# Altium schematic sheet power.SchDoc
size A4; Revision: C.2(PCB.SCH)
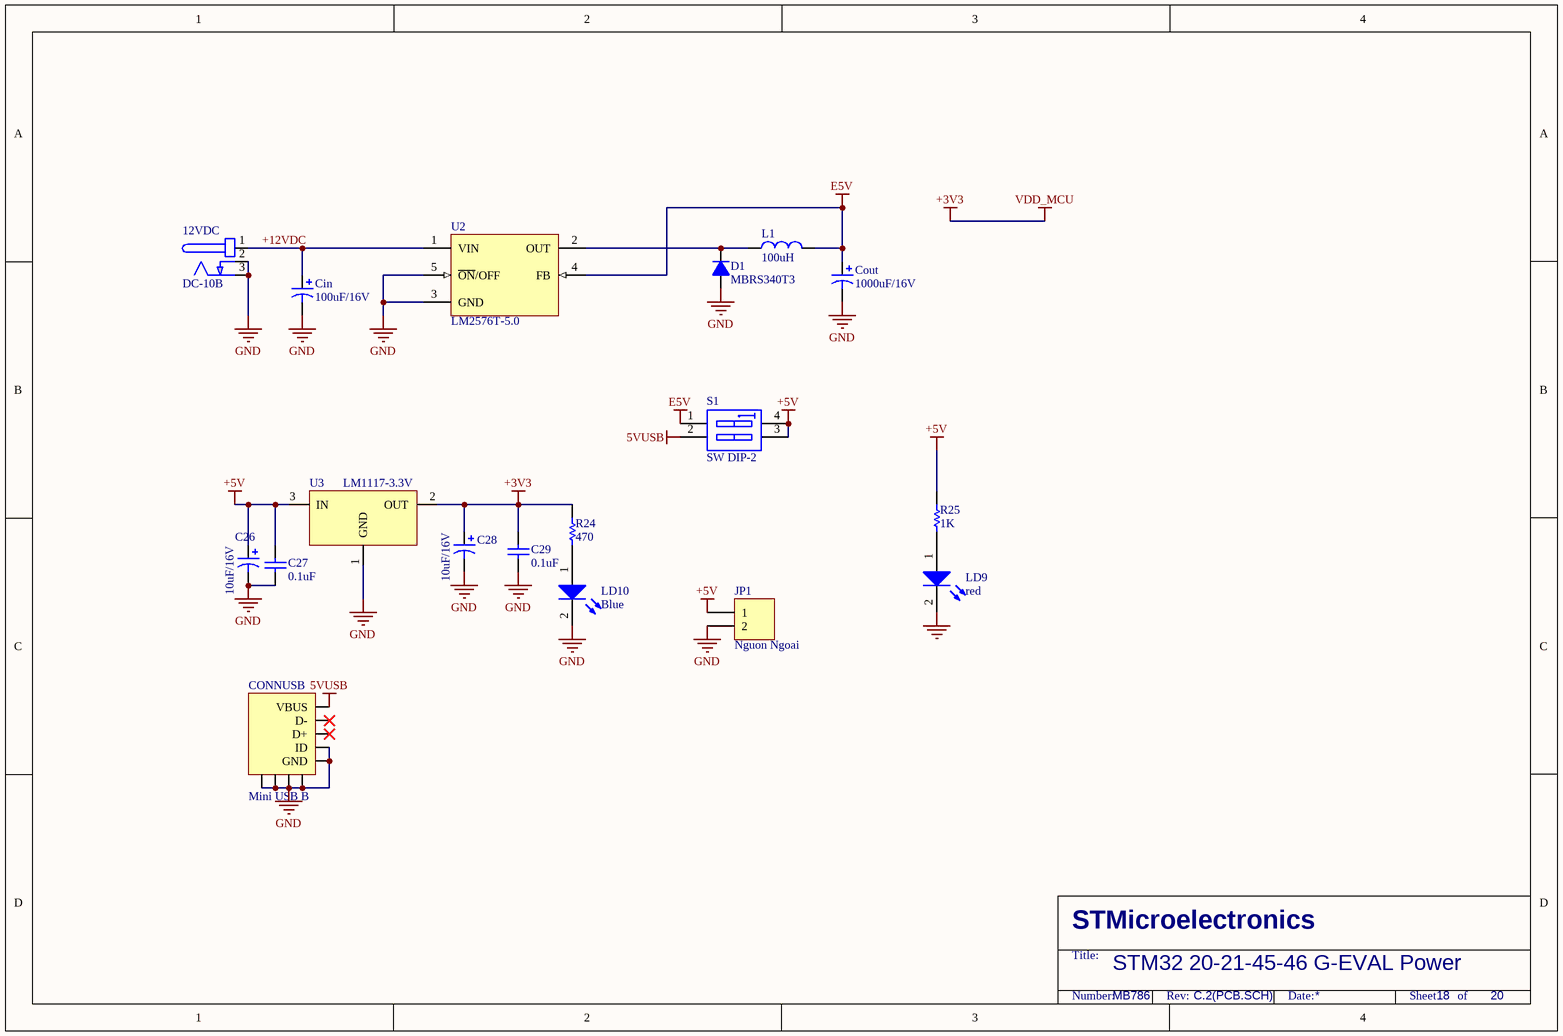
[diagram p0: power.SchDoc]

## Parts
12VDC  DC-10B  [DC IN]
C26  10uF/16V  [AVX-CAPC3528_V]
C27  0.1uF  [0603_C]
C28  10uF/16V  [AVX-CAPC3528_V]
C29  0.1uF  [0603_C]
Cin  100uF/16V  [CAPAE660X540N]
CONNUSB  Mini USB B  [USB MINI B RECEPTACLE]
Cout  1000uF/16V  [CAPAE1030X1020N]
D1  MBRS340T3  [DO-214AB]
JP1  Nguon Ngoai  [HDR1X2]
L1  100uH  [IND_BOURNS_PM127SH]
LD9  red  [0805_LED]
LD10  Blue  [0805_LED]
R24  470  [0603_R]
R25  1K  [0603_R]
S1  SW DIP-2  [SW_OMRON_A6S-2102-H]
U2  LM2576T-5.0  [TO263-5]
U3  LM1117-3.3V  [SOT223-4N]

## Nets
5VUSB: CONNUSB.1(VBUS) S1.2(A2)
+3V3: C28.1 C29.1 R24.2 U3.2(OUT)  [also labelled VDD_MCU]
+5V: C26.1 C27.1 JP1.1 R25.2 S1.3(B2) S1.4(B1) U3.3(IN)
E5V: Cout.1 L1.2 S1.1(A1) U2.4(FB)
GND: 12VDC.2(GND) 12VDC.3(GND) C26.2 C27.2 C28.2 C29.2 Cin.2 CONNUSB.4(ID) CONNUSB.5(GND) CONNUSB.SHIELD Cout.2 D1.1(A) JP1.2 LD9.2(K) LD10.2(K) U2.3(GND) U2.5(~{ON}/OFF) U3.1(GND)
+12VDC: 12VDC.1(+) Cin.1 U2.1(VIN)
NetD1_2: D1.2(K) L1.1 U2.2(OUT)
NetLD9_1: LD9.1(A) R25.1
NetLD10_1: LD10.1(A) R24.1

Not connected (* = marked no-connect by the designer): CONNUSB 2(D-)* 3(D+)*

## Notes on the sheet
- STM32 20-21-45-46 G-EVAL Power
- MB786
- 18
- 20
- STMicroelectronics
- Title:
- Number:
- Rev:
- Date:
- Sheet       of

## Library data of the parts
12VDC = PJ202A
C26 = AVX-CAP-P-2: Tu Hoa
C27 C29 = Cap: Capacitor; Value: 100pF; Published: 8-Jun-2000; LatestRevisionDate: 17-Jul-2002; LatestRevisionNote: Re-released for DXP Platform.; PackageReference: RAD-0.3; Publisher: Altium Limited; PackageDescription: Radial Cap, Thru-Hole; 2 Leads; 0.3 in Pin Spacing
C28 Cin Cout = AVX-CAP-P-2: Tu hoa
CONNUSB = 10033526-N3212LF: FCI Mini USB B Recptacle Right Angle; Supplier 1: Digi-Key; Supplier Part Number 1: 609-4700-1-ND; Value: Mini USB B
D1 = D1A: Diode 1A; Value: 1N4007
JP1 = Header 2: Header, 2-Pin; LatestRevisionDate: 17-Jul-2002; LatestRevisionNote: Re-released for DXP Platform.; Publisher: Altium Limited
L1 = L1: Inductor; Value: 150 mH
LD9 LD10 = LED2: Typical RED, GREEN, YELLOW, AMBER GaAs LED; Published: 8-Jun-2000; Revision: July-2002: Re-released for DXP Platform.; Publisher: Altium Limited
R24 = res1: Resistor; Value: 1K; Published: 8-Jun-2000; Revision: July-2002: Re-released for DXP Platform.; Publisher: Altium Limited
R25 = res1: Resistor; Published: 8-Jun-2000; Revision: July-2002: Re-released for DXP Platform.; Publisher: Altium Limited; Value: 1K
S1 = SW DIP-2: DIP Switch, 2 Position, SPST; Published: 24-Mar-1999; LatestRevisionDate: 17-Jul-2002; LatestRevisionNote: Re-released for DXP Platform.; PackageReference: DIP-4; Publisher: Altium Limited
U2 = LM2576T-5.0: SIMPLE SWITCHER; 3A Step-Down Voltage Regulator; Manufacturer: National Semiconductor; PackageTopMarking: NSUZXYTT*LM2576T*-5.0 P+; PowerWise: N; FirstPublished: 4-Dec-2008; DatasheetVersion: Aug-2004; PackageVersion: revJ, Jan-1992; PackageReference: T05A; Publisher: Altium Limited; PackageDescription: TO-220, Molded, 5 Lead, Straight; CompType: Switcher; PartNumber: LM2576T-5.0; RoHS: O; PinCount: 5; DigiKeyPartNumber: LM2576T-5.0-ND; Code_JEDEC: TO-220-AB; ComponentLink1Description: LM2576 Datasheet; ComponentLink1URL: http://www.national.com/ds/LM/LM2576.pdf; ComponentLink2Description: LM2576 Web Page; ComponentLink2URL: http://www.national.com/pf/LM/LM2576.html; ComponentLink3Description: T05A Package Page; ComponentLink3URL: http://www.national.com/packaging/folders/t05a.html
U3 = LM1117: 800mA Low-Dropout Linear Regulator; Creator: Nguyen Ba Bien; Website: http://group3i.net